# Altium schematic sheet pump.SchDoc
size A4
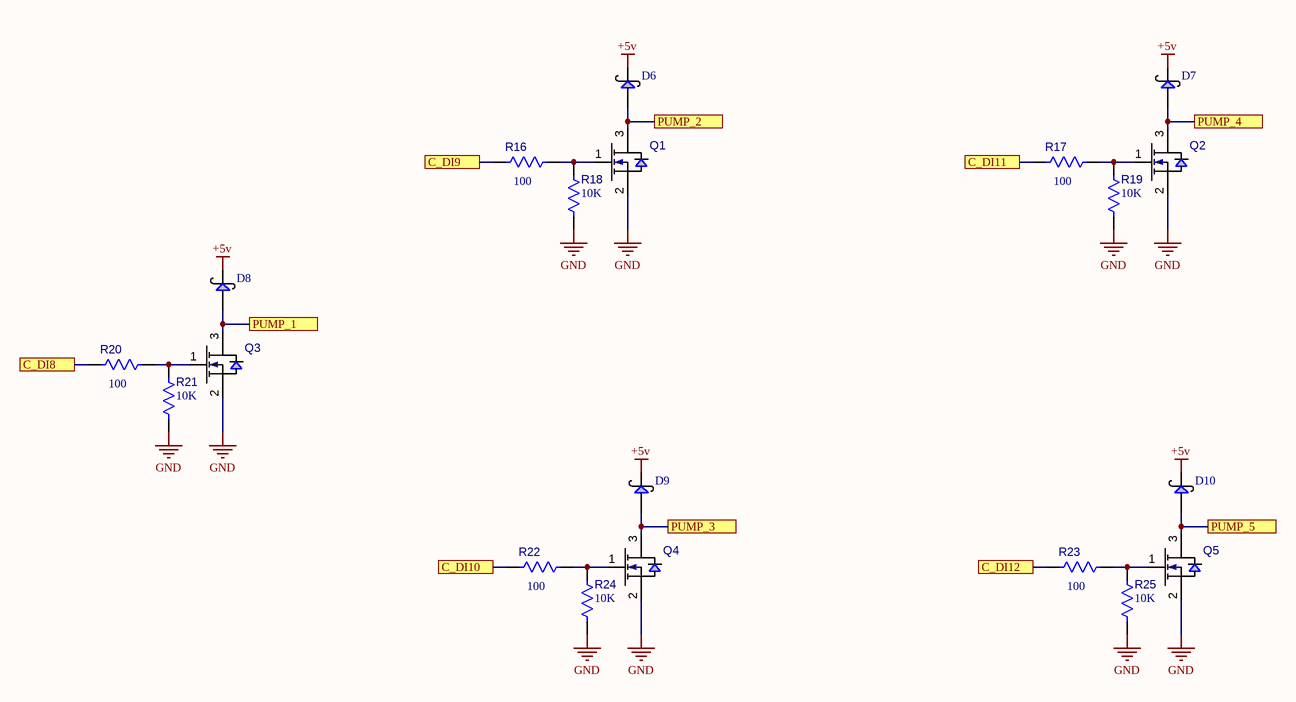
[diagram p0: pump.SchDoc]

## Parts
D6  (no value)  [SOD123]
D7  (no value)  [SOD123]
D8  (no value)  [SOD123]
D9  (no value)  [SOD123]
D10  (no value)  [SOD123]
Q1  BSS138  [SOT23_N_123]  (value not drawn)
Q2  BSS138  [SOT23_N_123]  (value not drawn)
Q3  BSS138  [SOT23_N_123]  (value not drawn)
Q4  BSS138  [SOT23_N_123]  (value not drawn)
Q5  BSS138  [SOT23_N_123]  (value not drawn)
R16  100  [0805]
R17  100  [0805]
R18  10K  [0805]
R19  10K  [0805]
R20  100  [0805]
R21  10K  [0805]
R22  100  [0805]
R23  100  [0805]
R24  10K  [0805]
R25  10K  [0805]

## Ports
C_DI8, C_DI9, C_DI10, C_DI11, C_DI12, PUMP_1, PUMP_2, PUMP_3, PUMP_4, PUMP_5

## Nets
+5v: D6.2 D7.2 D8.2 D9.2 D10.2
GND: Q1.2 Q2.2 Q3.2 Q4.2 Q5.2 R18.1 R19.1 R21.1 R24.1 R25.1
C_DI8: R20.1 ; port C_DI8
C_DI9: R16.1 ; port C_DI9
C_DI10: R22.1 ; port C_DI10
C_DI11: R17.1 ; port C_DI11
C_DI12: R23.1 ; port C_DI12
PUMP_1: D8.1 Q3.3 ; port PUMP_1
PUMP_2: D6.1 Q1.3 ; port PUMP_2
PUMP_3: D9.1 Q4.3 ; port PUMP_3
PUMP_4: D7.1 Q2.3 ; port PUMP_4
PUMP_5: D10.1 Q5.3 ; port PUMP_5
NetQ1_1: Q1.1 R16.2 R18.2
NetQ2_1: Q2.1 R17.2 R19.2
NetQ3_1: Q3.1 R20.2 R21.2
NetQ4_1: Q4.1 R22.2 R24.2
NetQ5_1: Q5.1 R23.2 R25.2

## Library data of the parts
D6-D10 = MBRX160: SOD123
Q1-Q5 = BSS138: N-Channel MOSFET; Manufacturer: Fairchild; Voltage-Rated: 50V; Value: 6 Ohm Rdson; Package: SOT23
R16-R25 = Res: Resistor; Tolerance: 1%; Package: 0603
  R16 R17 R20 R22 R23: Value: 100
  R18 R19 R21 R24 R25: Value: 10K